# Altium project jalase4.PrjPcb
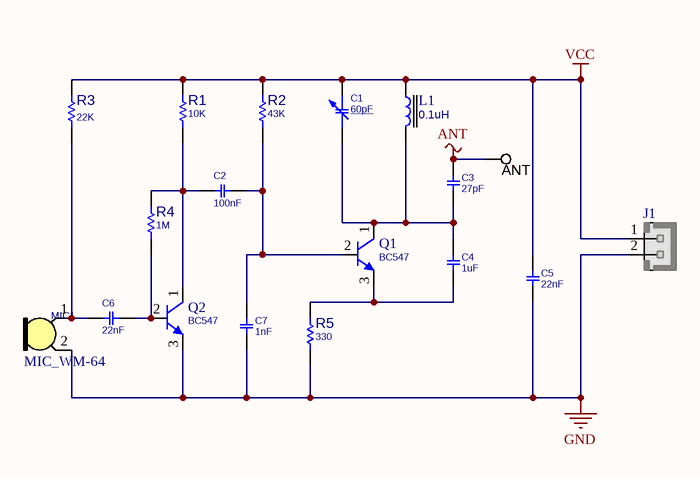
[diagram p0: Sheet1.SchDoc]
1 sheet, 18 parts. Net scope: global (net labels, ports and power ports of the same name join across sheets).
Board file: PCB1.PcbDoc

## Sheet Sheet1.SchDoc
size A; SheetNumber: 1; SheetTotal: 1

### Parts
ANT  TESTPOINT_MINI  [TPTHD_A]  (value not drawn)  (no BOM)
C1  60pF  [CTRM_6X6]
C2  100nF  [C_CERM_D3]
C3  27pF  [C_CERM_D3]
C4  1uF  [C_CERM_D3]
C5  22nF  [C_CERM_D3]
C6  22nF  [C_CERM_D3]
C7  1nF  [C_CERM_D3]
J1  HHDR_2  [XH_2]  (value not drawn)
L1  0.1uH  [LT_AX025]
MIC1  MIC_WM-64  [MIC_C6]
Q1  BC547  [TO92_3]
Q2  BC547  [TO92_3]
R1  10K  [R025W_AX04]
R2  43K  [R025W_AX04]
R3  22K  [R025W_AX04]
R4  1M  [R025W_AX04]
R5  330  [R025W_AX04]

### Nets
ANT: ANT.1 C3.1
GND: C5.2 C7.1 J1.2 MIC1.2(GND) Q2.3(E) R5.1
VCC: C1.2 C5.1 J1.1 L1.1 R1.2 R2.2 R3.2
NetC1_1: C1.1 C3.2 C4.1 L1.2 Q1.1(C)
NetC2_1: C2.1 C7.2 Q1.2(B) R2.1
NetC2_2: C2.2 Q2.1(C) R1.1 R4.2
NetC4_2: C4.2 Q1.3(E) R5.2
NetC6_1: C6.1 Q2.2(B) R4.1
NetC6_2: C6.2 MIC1.1(OUT) R3.1

### Library data of the parts
ANT = TESTPOINT_MINI: TEST POINT; MANF: MANF; MANF_P#: MANF_P#; VALUE: VALUE
C1 = CAP_THD_TRIMMER: CAP, THD, TRIMMER; DESC: CAP, SMD, TRIMMER; MANF_P#: MANF_PART#; PARAM: PARAM; PRICE: 100= 1$; MANF: MANF; PARAM2: PARAM2; ASSEMBLY: ASSEMBLY; VALUE: 60pF
C2-C7 = CAP_THD_CER: CAP, THD, CER MULTI LAYER,; DESC: CAP, CER MULTI LAYER,; MANF_P#: MANF_PART#; PARAM2: 50V; PRICE: 100= 1$; MANF: MANF; ASSEMBLY: ASSEMBLY
  C2: VALUE: 100nF
  C3: VALUE: 27pF
  C4: VALUE: 1uF
  C5 C6: VALUE: 22nF
  C7: VALUE: 1nF
J1 = XH_2: JST-XH pitch: 2.5mm; VALUE: HHDR_2
L1 = IND_THD: INDUCTOR, THD; VALUE: 0.1uH
MIC1 = MIC_WM-64: MICROPHONE OMNI 6X2.2MM W/CAP 2.2KOHM -44DB TH; MANF_P#: WM-64PNT; PRICE: PRICE; Value: MIC_WM-64
Q1 Q2 = NPN_BC547_TO92: BJT, NPN, 45v, 0.1A, THD, TO92; PARAM: 0.1A, Hfe110~800; PARAM2: 45v, 500mW; MANF: FAIRCHILD; MANF_P#: BC547; VALUE: BC547
R1-R5 = RES_THD: RESISTOR, THD; MANF_P#: RK73H1ETTP4701F; MANF: KOA SPEER; PARAM: 0.063W; DESC: DESCRIPTION; DIST#: MOUSER; PARAM2: 1%; ASSEMBLY: ASSEMBLY; PRICE: 100= 0.5$
  R1: VALUE: 10K
  R2: VALUE: 43K
  R3: VALUE: 22K
  R4: VALUE: 1M
  R5: VALUE: 330